# Altium schematic sheet MCU.SchDoc
size A4
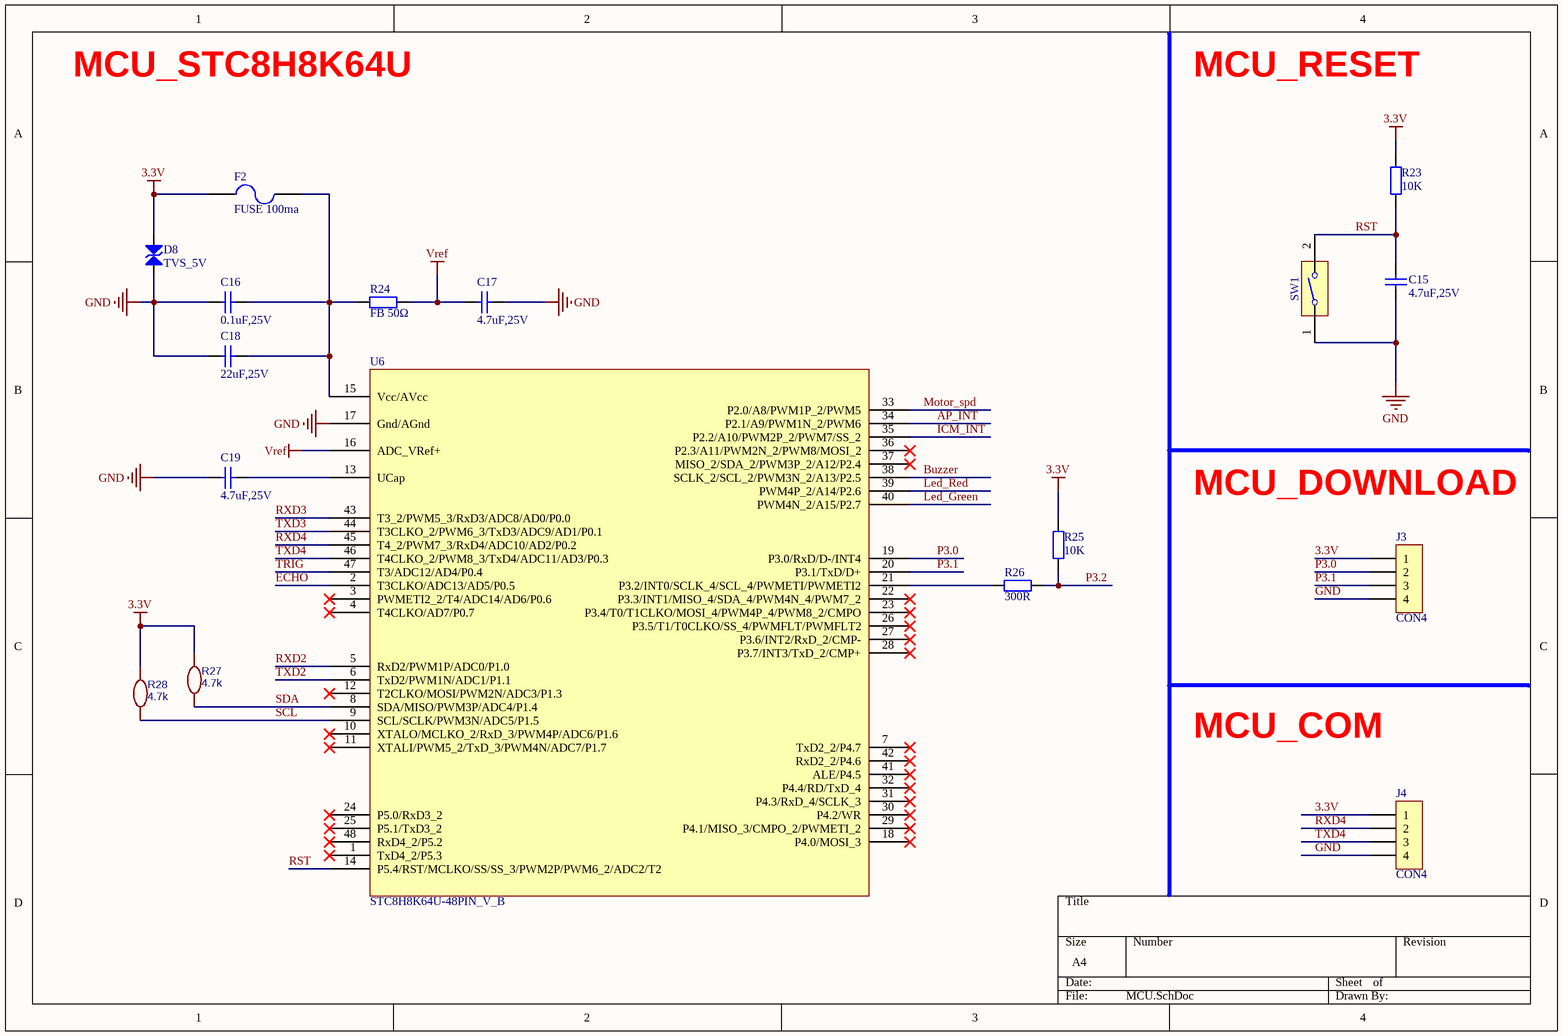
[diagram p0: MCU.SchDoc]

## Parts
C15  value 4.7uF,25V  [0603_C]  (hidden comment: Cap)
C16  value 0.1uF,25V  [0603_C]  (hidden comment: Cap)
C17  value 4.7uF,25V  [0603_C]  (hidden comment: Cap)
C18  value 22uF,25V  [0603_C]  (hidden comment: Cap)
C19  value 4.7uF,25V  [0603_C]  (hidden comment: Cap)
D8  TVS_5V  [SOD-323]
F2  FUSE 100ma  [1206_FUSE]
J3  CON4
J4  CON4
R23  value 10K  [0603_R]  (hidden comment: Res)
R24  value FB 50Ω  [0603_R]  (hidden comment: Res)
R25  value 10K  [0603_R]  (hidden comment: Res)
R26  value 300R  [0603_R]  (hidden comment: Res)
R27  4.7k  [0402_R]
R28  4.7k  [0402_R]
SW1  (no value)
U6  STC8H8K64U-48PIN_V_B  [QFN48(6X6mm)]

## Nets
3.3V: D8.1 F2.2 J3.1 J4.1 R23.1 R25.1 R27.1 R28.1
GND: C15.2 C16.1 C17.1 C18.1 C19.2 D8.2 J3.4 J4.4 SW1.1 U6.17(Gnd/AGnd)
Vref: C17.2 R24.1 U6.16(ADC_VRef+)
AP_INT: U6.34(P2.1/A9/PWM1N_2/PWM6)
Buzzer: U6.38(SCLK_2/SCL_2/PWM3N_2/A13/P2.5)
ECHO: U6.2(T3CLKO/ADC13/AD5/P0.5)
ICM_INT: U6.35(P2.2/A10/PWM2P_2/PWM7/SS_2)
Led_Green: U6.40(PWM4N_2/A15/P2.7)
Led_Red: U6.39(PWM4P_2/A14/P2.6)
Motor_spd: U6.33(P2.0/A8/PWM1P_2/PWM5)
P3.0: J3.2 U6.19(P3.0/RxD/D-/INT4)
P3.1: J3.3 U6.20(P3.1/TxD/D+)
P3.2: R25.2 R26.2
RST: C15.1 R23.2 SW1.2 U6.14(P5.4/RST/MCLKO/SS/SS_3/PWM2P/PWM6_2/ADC2/T2)
RXD2: U6.5(RxD2/PWM1P/ADC0/P1.0)
RXD3: U6.43(T3_2/PWM5_3/RxD3/ADC8/AD0/P0.0)
RXD4: J4.2 U6.45(T4_2/PWM7_3/RxD4/ADC10/AD2/P0.2)
SCL: R28.2 U6.9(SCL/SCLK/PWM3N/ADC5/P1.5)
SDA: R27.2 U6.8(SDA/MISO/PWM3P/ADC4/P1.4)
TRIG: U6.47(T3/ADC12/AD4/P0.4)
TXD2: U6.6(TxD2/PWM1N/ADC1/P1.1)
TXD3: U6.44(T3CLKO_2/PWM6_3/TxD3/ADC9/AD1/P0.1)
TXD4: J4.3 U6.46(T4CLKO_2/PWM8_3/TxD4/ADC11/AD3/P0.3)
NetC16_2: C16.2 C18.2 F2.1 R24.2 U6.15(Vcc/AVcc)
NetC19_1: C19.1 U6.13(UCap)
NetR26_1: R26.1 U6.21(P3.2/INT0/SCLK_4/SCL_4/PWMETI/PWMETI2)

Not connected (* = marked no-connect by the designer): U6 1(TxD4_2/P5.3)* 3(PWMETI2_2/T4/ADC14/AD6/P0.6)* 4(T4CLKO/AD7/P0.7)* 7(TxD2_2/P4.7)* 10(XTALO/MCLKO_2/RxD_3/PWM4P/ADC6/P1.6)* 11(XTALI/PWM5_2/TxD_3/PWM4N/ADC7/P1.7)* 12(T2CLKO/MOSI/PWM2N/ADC3/P1.3)* 18(P4.0/MOSI_3)* 22(P3.3/INT1/MISO_4/SDA_4/PWM4N_4/PWM7_2)* 23(P3.4/T0/T1CLKO/MOSI_4/PWM4P_4/PWM8_2/CMPO)* 24(P5.0/RxD3_2)* 25(P5.1/TxD3_2)* 26(P3.5/T1/T0CLKO/SS_4/PWMFLT/PWMFLT2)* 27(P3.6/INT2/RxD_2/CMP-)* 28(P3.7/INT3/TxD_2/CMP+)* 29(P4.1/MISO_3/CMPO_2/PWMETI_2)* 30(P4.2/WR)* 31(P4.3/RxD_4/SCLK_3)* 32(P4.4/RD/TxD_4)* 36(P2.3/A11/PWM2N_2/PWM8/MOSI_2)* 37(MISO_2/SDA_2/PWM3P_2/A12/P2.4)* 41(ALE/P4.5)* 42(RxD2_2/P4.6)* 48(RxD4_2/P5.2)*

## Notes on the sheet
- MCU_STC8H8K64U
- MCU_RESET
- MCU_DOWNLOAD
- MCU_COM

## Library data of the parts
C15-C19 = T_Cap_0603_2.2uF_25V_Y5V: 贴片电容; Part Typer: Y5V; Solder: SMD; Withstand Voltage: 25V; Tolerance: 20%; Schematic Path: X:\Database\Schematic Library.Schlib; Part Number: T_Cap_0603_2.2uF_25V_Y5V; LibRef: T_Cap_0603_2.2uF_25V_Y5V
D8 = TBV05C: TVS,ESD二极管
F2 = Fuse 2: Fuse; Published: 8-Jun-2000; LatestRevisionDate: 17-Jul-2002; LatestRevisionNote: Re-released for DXP Platform.; PackageReference: PIN-W2/E2.8; Publisher: Altium Limited
J3 J4 = CON4: Connector
R23-R26 = T_Res_0603_49.9k_1%_1/10W: 贴片电阻; Solder: SMD; Power: 1/10W; Tolerance: 1%; Schematic Path: X:\Database\Schematic Library.Schlib; Part Number: T_Res_0603_49.9k_1%_1/10W; LibRef: T_Res_0603_49.9k_1%_1/10W
R27 R28 = 100k: nameAlias: Value(Ω); Contributor: LCEDA_Lib; spicePre: R; spiceSymbolName: R_0603_EU
SW1 = SW 1x SPST DIP Switch: 1 Ways SPST DIP Switch
U6 = STC8H8K64U-48PIN